# EAGLE board Main Board - Double (EAGLE 9.6.2)
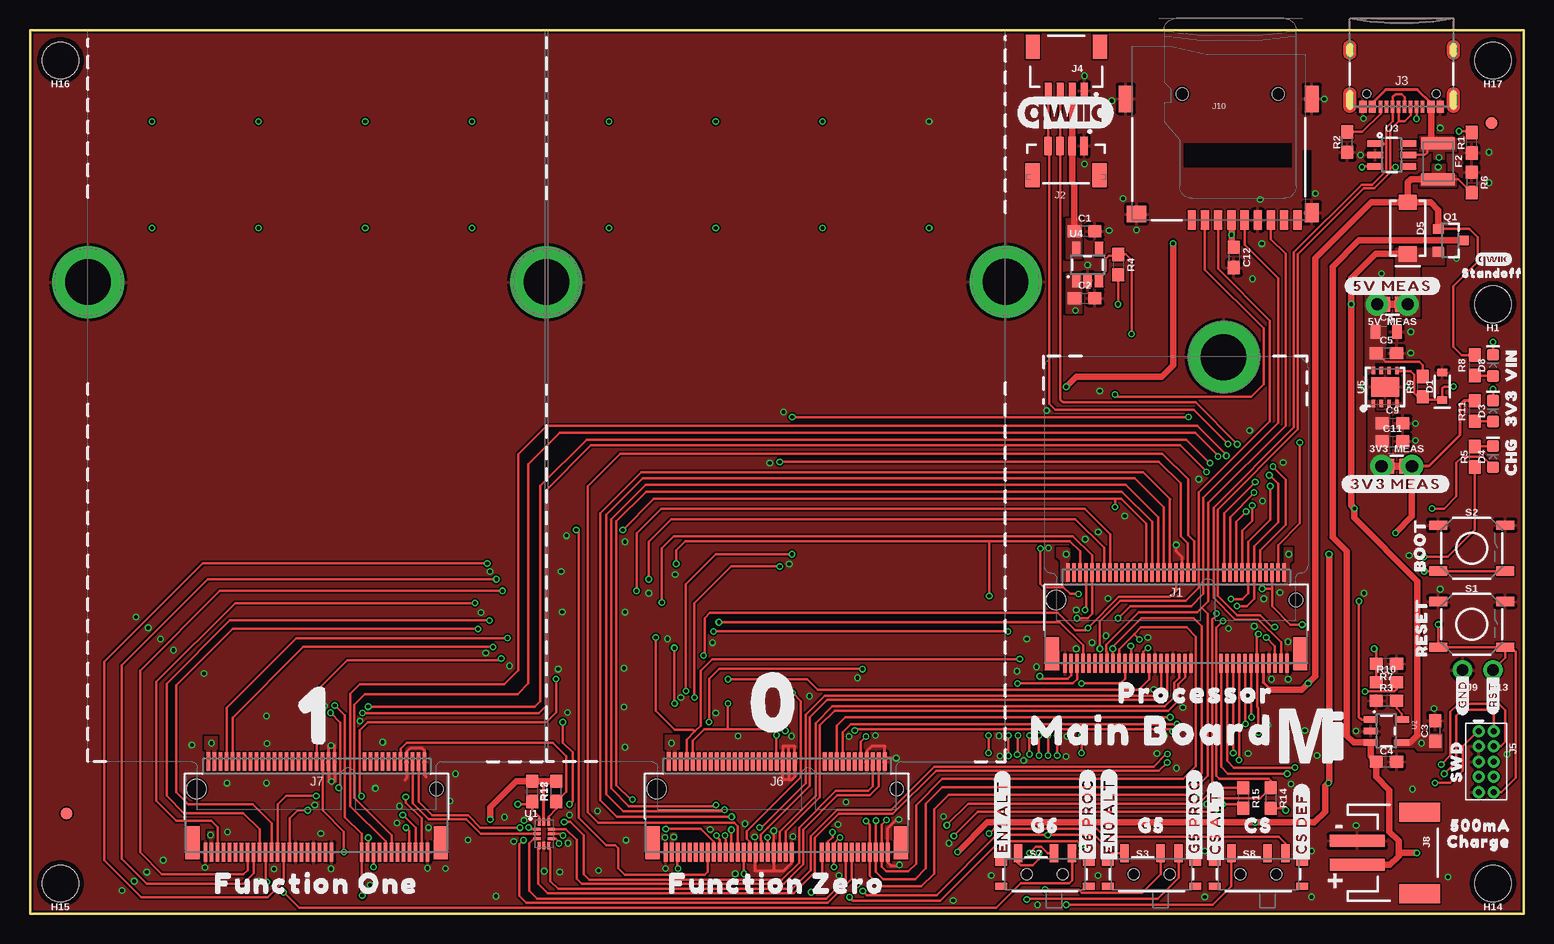
[diagram p1: board, top side]
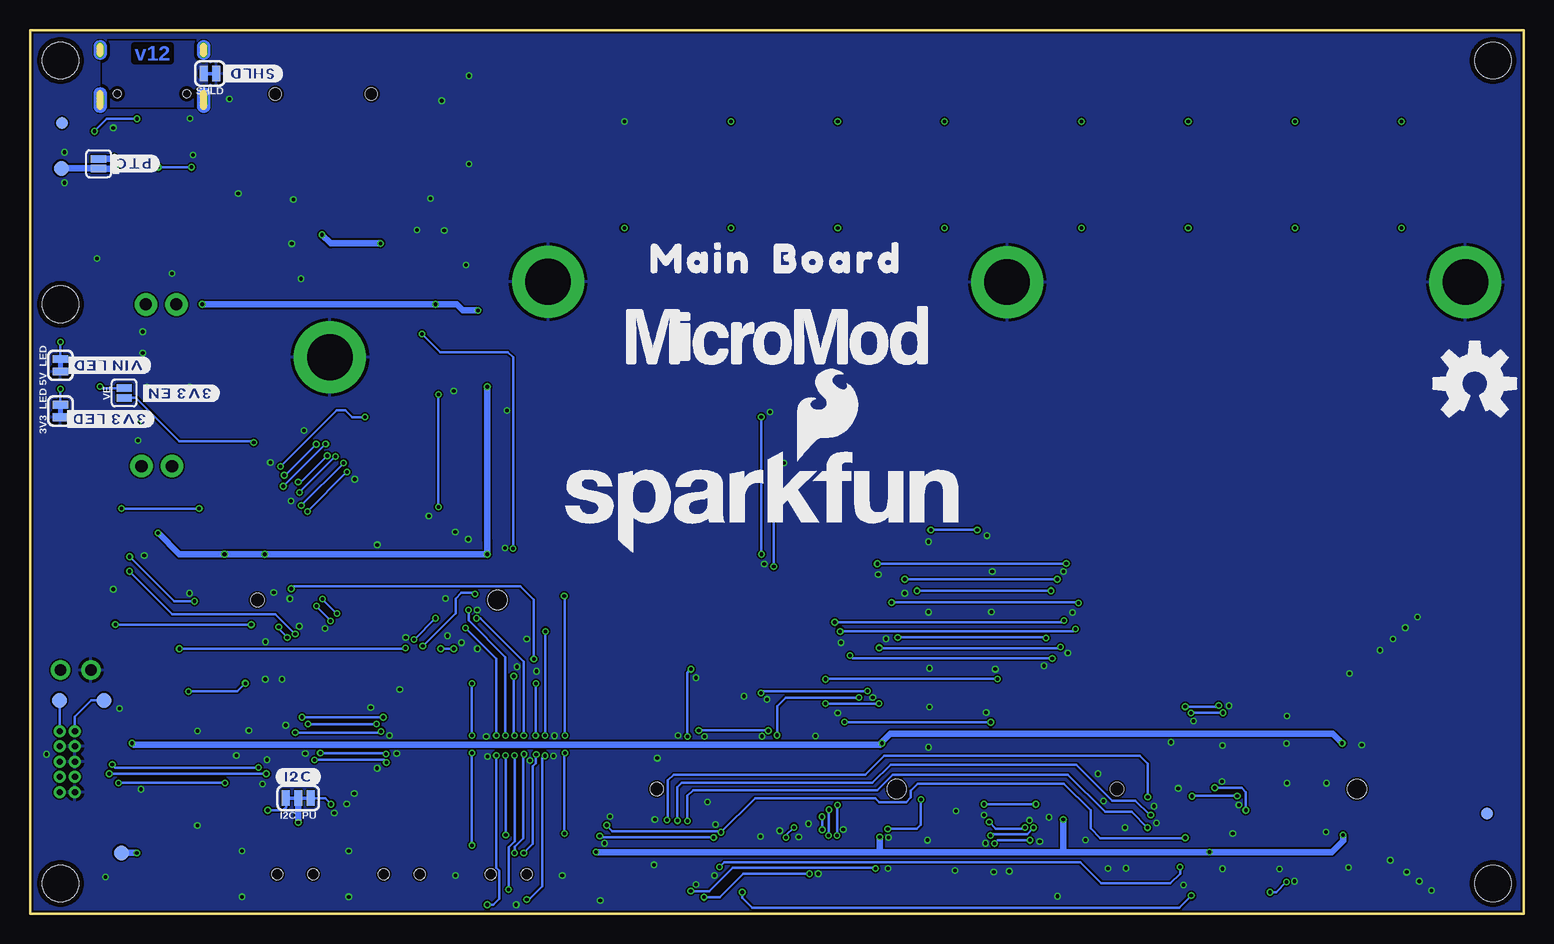
[diagram p2: board, bottom side, seen from below]

Size 124.46 x 73.66 mm. Coordinates in mm from the lower left corner, seen from the top.
Outline: 0,73.66 124.46,73.66 124.46,0 0,0 0,73.66
Copper layers (1*16): Top 0.035mm / dielectric 1.5mm / Bottom 0.035mm
Design rules "SparkFun-2-Layer-Minimum-JLCPCB": minimum track width 5mil, minimum drill 0.3mm, track to track 5mil, track to pad 5mil, pad to pad 5mil, via to via 5mil, smd to smd 5mil, copper to edge 7mil, drill to drill 7mil, minimum pad ring 5mil, minimum via ring 5mil, stop-mask expansion 2.5mil, vias tented up to drill 25mil, thermal gap 10mil
Net classes: 0 default: width 0.178 mm, drill 0.305 mm; 1 POWER: width 0.559 mm, drill 0.305 mm; 2 Diff pairs: width 0.203 mm, drill 0.305 mm
tRestrict: area 25.1,12.5 to 25.2,12.9; area 25.6,12.5 to 25.7,12.9; area 62.9,12.5 to 63,12.9; area 63.4,12.5 to 63.6,12.9

## Footprints (pad centres in the part's own frame; a part is rotated, then mirrored left to right if it is on the bottom)
SMT-JUMPER_2_NC_TRACE_SILK = smd 0.66 x 1.27: 1 -0.521,0; 2 0.521,0
COMBO-JUMPER_2_NC_TRACE = smd 0.635 x 1.27: 1 -0.508,0; 2 0.508,0 | drill 1.016 pad 1.88: 3 -1.27,0; 4 1.27,0
SMT-JUMPER_2_NO_SILK = smd 0.635 x 1.27: 1 -0.406,0; 2 0.406,0
0603 = smd 1.1 x 1: 1 -0.85,0; 2 0.85,0
0805 = smd 0.8 x 1.2: 1 -0.9,0; 2 0.9,0
SOD-323 = smd 0.63 x 0.83: A 1.15,0; C -1.15,0
LED-0603 = smd 1 x 1: A -0.877,0; C 0.877,0
SMA-DIODE = smd 1.27 x 1.47: A -2.15,0; C 2.15,0
1210 = smd 1 x 2.8: 1 -1.5,0; 2 1.5,0
FIDUCIAL-1X2 = smd 1 x 1: 1 0,0
STAND-OFF-TIGHT = hole 3.048: 0,0
STAND-OFF-REFLOW-M2.5 = drill 3.8 pad 6: 1 0,0
SMT-JUMPER_3_2-NC_TRACE_SILK = smd 0.66 x 1.27: 1 -1.041,0; 2 0,0; 3 1.041,0
M.2-CONNECTOR-E = smd 0.3 x 1.55: 1 9.25,-5.275; 2 9,2.275; 3 8.75,-5.275; 4 8.5,2.275; 5 8.25,-5.275; 6 8,2.275; 7 7.75,-5.275; 8 7.5,2.275; 9 7.25,-5.275; 10 7,2.275; 11 6.75,-5.275; 12 6.5,2.275; 13 6.25,-5.275; 14 6,2.275; 15 5.75,-5.275; 16 5.5,2.275; 17 5.25,-5.275; 18 5,2.275; 19 4.75,-5.275; 20 4.5,2.275; 21 4.25,-5.275; 22 4,2.275; 23 3.75,-5.275; 32 1.5,2.275; 33 1.25,-5.275; 34 1,2.275; 35 0.75,-5.275; 36 0.5,2.275; 37 0.25,-5.275; 38 0,2.275; 39 -0.25,-5.275; 40 -0.5,2.275; 41 -0.75,-5.275; 42 -1,2.275; 43 -1.25,-5.275; 44 -1.5,2.275; 45 -1.75,-5.275; 46 -2,2.275; 47 -2.25,-5.275; 48 -2.5,2.275; 49 -2.75,-5.275; 50 -3,2.275; 51 -3.25,-5.275; 52 -3.5,2.275; 53 -3.75,-5.275; 54 -4,2.275; 55 -4.25,-5.275; 56 -4.5,2.275; 57 -4.75,-5.275; 58 -5,2.275; 59 -5.25,-5.275; 60 -5.5,2.275; 61 -5.75,-5.275; 62 -6,2.275; 63 -6.25,-5.275; 64 -6.5,2.275; 65 -6.75,-5.275; 66 -7,2.275; 67 -7.25,-5.275; 68 -7.5,2.275; 69 -7.75,-5.275; 70 -8,2.275; 71 -8.25,-5.275; 72 -8.5,2.275; 73 -8.75,-5.275; 74 -9,2.275; 75 -9.25,-5.275 | smd 1.2 x 2.75: A1 10.35,-4.5; A2 -10.35,-4.5 | hole 1.1: 10,0 | hole 1.6: -10,0
JST04_1MM_VERT = smd 0.6 x 1.55: 1 -1.478,0.775; 2 -0.478,0.775; 3 0.522,0.775; 4 1.522,0.775 | smd 1.2 x 2: NC1 -2.778,3.2; NC2 2.822,3.2
USB-C-16P-2LAYER-PADS = smd 0.3 x 1: A5 -1.25,-0.34; A6 -0.25,-0.34; A7 0.25,-0.34; A8 1.25,-0.34; B5 1.75,-0.34; B6 0.75,-0.34; B7 -0.75,-0.34; B8 -1.75,-0.34 | smd 0.6 x 1: GND -3.225,-0.34; GND2 3.225,-0.34; VBUS1 -2.45,-0.34; VBUS2 2.45,-0.34 | drill 0.4 pad 0.6 long: SHLD1 -4.318,-0.915; SHLD2 4.318,-0.915; SHLD3 -4.318,-5.095; SHLD4 4.318,-5.095 | hole 0.65: -2.89,-1.445; 2.89,-1.445
JST04_1MM_RA = smd 0.6 x 1.35: 1 -1.5,0; 2 -0.5,0; 3 0.5,0; 4 1.5,0 | smd 1.2 x 2: NC1 2.8,-3.675; NC2 -2.8,-3.675
2X5-PTH-1.27MM = drill 0.508 pad 1: 1 -2.54,-0.635; 2 -2.54,0.635; 3 -1.27,-0.635; 4 -1.27,0.635; 5 0,-0.635; 6 0,0.635; 7 1.27,-0.635; 8 1.27,0.635; 9 2.54,-0.635; 10 2.54,0.635
M.2-CONNECTOR-E-FUNCTION-STANDARD = smd 0.3 x 1.55: 1 9.25,-5.275; 2 9,2.275; 3 8.75,-5.275; 4 8.5,2.275; 5 8.25,-5.275; 6 8,2.275; 7 7.75,-5.275; 8 7.5,2.275; 9 7.25,-5.275; 10 7,2.275; 11 6.75,-5.275; 12 6.5,2.275; 13 6.25,-5.275; 14 6,2.275; 15 5.75,-5.275; 16 5.5,2.275; 17 5.25,-5.275; 18 5,2.275; 19 4.75,-5.275; 20 4.5,2.275; 21 4.25,-5.275; 22 4,2.275; 23 3.75,-5.275; 32 1.5,2.275; 33 1.25,-5.275; 34 1,2.275; 35 0.75,-5.275; 36 0.5,2.275; 37 0.25,-5.275; 38 0,2.275; 39 -0.25,-5.275; 40 -0.5,2.275; 41 -0.75,-5.275; 42 -1,2.275; 43 -1.25,-5.275; 44 -1.5,2.275; 45 -1.75,-5.275; 46 -2,2.275; 47 -2.25,-5.275; 48 -2.5,2.275; 49 -2.75,-5.275; 50 -3,2.275; 51 -3.25,-5.275; 52 -3.5,2.275; 53 -3.75,-5.275; 54 -4,2.275; 55 -4.25,-5.275; 56 -4.5,2.275; 57 -4.75,-5.275; 58 -5,2.275; 59 -5.25,-5.275; 60 -5.5,2.275; 61 -5.75,-5.275; 62 -6,2.275; 63 -6.25,-5.275; 64 -6.5,2.275; 65 -6.75,-5.275; 66 -7,2.275; 67 -7.25,-5.275; 68 -7.5,2.275; 69 -7.75,-5.275; 70 -8,2.275; 71 -8.25,-5.275; 72 -8.5,2.275; 73 -8.75,-5.275; 74 -9,2.275; 75 -9.25,-5.275 | smd 1.2 x 2.75: A1 10.35,-4.5; A2 -10.35,-4.5 | hole 1.1: 10,0 | hole 1.6: -10,0
JST-2-SMD = smd 1 x 4.6: 1 -1,-3.7; 2 1,-3.7 | smd 1.6 x 3.4: NC1 -3.4,1.5; NC2 3.4,1.5
1X01_NO_SILK = drill 0.95 pad 1.6: 1 0,0
MICROSD-EXTERNALPIN = smd 0.7 x 1.6: 1 2.25,10.5; 2 1.15,10.5; 3 0.05,10.5; 4 -1.05,10.5; 5 -2.15,10.5; 6 -3.25,10.5; 7 -4.35,10.5; 8 -5.45,10.5; 9 -6.55,10.5 | smd 1.2 x 1.6: 10 -7.75,9.9 | smd 1.2 x 2.2: 11 -7.75,0.4; 12 7.75,0.4 | smd 1.6 x 1.4: 13 6.85,10 | hole 1: 3.05,0; -4.95,0
SOT23-3 = smd 0.8 x 0.9: 1 -0.95,-1; 2 0.95,-1; 3 0,1.1
TACTILE_SWITCH_SMD_5.2MM = smd 1.524 x 0.762: 1 -2.794,1.905; 2 2.794,1.905; 3 -2.794,-1.905; 4 2.794,-1.905
SWITCH_SPST_SMD_A = smd 0.7 x 1.5: 1 -2.25,-1.75; 2 -0.75,-1.75; 3 2.25,-1.75 | smd 1 x 0.6: GND1 -3.65,1; GND3 3.65,1 | smd 1 x 0.8: GND2 -3.65,-1.1; GND4 3.65,-1.1 | hole 0.9: -1.5,0; 1.5,0
PAD.03X.05 = smd 1.27 x 1.27: 1 0,0
STG3856 = smd 0.6 x 0.25: P1 -0.59,0.41; P2 -0.59,0.01; P3 -0.59,-0.39; P7 0.58,-0.39; P8 0.58,0.01; P9 0.58,0.41 | smd 0.25 x 0.6: P4 -0.42,-0.96; P5 -0.02,-0.96; P6 0.38,-0.96; P10 0.38,1.01; P11 -0.02,1.01; P12 -0.42,1.01
SOT23-5 = smd 0.55 x 1.2: 1 -0.95,-1.3; 2 0,-1.3; 3 0.95,-1.3; 4 0.95,1.3; 5 -0.95,1.3
SOT-23-6 = smd 0.55 x 1.35: 1 -0.95,-1.375; 2 0,-1.375; 3 0.95,-1.375; 4 0.95,1.375; 5 0,1.375; 6 -0.95,1.375
SOT25 = smd 0.7 x 1.2: 1 -0.95,-1.3; 2 0,-1.3; 3 0.95,-1.3; 4 0.95,1.3; 5 -0.95,1.3
UDFN-8 = smd 0.3 x 0.65: 1 -0.975,-1.375; 2 -0.325,-1.375; 3 0.325,-1.375; 4 0.975,-1.375; 5 0.975,1.375; 6 0.325,1.375; 7 -0.325,1.375; 8 -0.975,1.375 | smd 2.35 x 1.6: EP 0,0

## Placement (x,y rotation side)
3V3_LED  JUMPER-SMT_2_NC_TRACE_SILK  [SMT-JUMPER_2_NC_TRACE_SILK]  121.92,41.91 90 bottom
3V3_MEAS  JUMPER-COMBO_2_NC_TRACE  [COMBO-JUMPER_2_NC_TRACE]  113.89,37.31 0 top
5V_LED  JUMPER-SMT_2_NC_TRACE_SILK  [SMT-JUMPER_2_NC_TRACE_SILK]  121.92,45.72 90 bottom
5V_MEAS  JUMPER-COMBO_2_NC_TRACE  [COMBO-JUMPER_2_NC_TRACE]  113.54,50.8 180 top
BYP  JUMPER-SMT_2_NO_SILK  [SMT-JUMPER_2_NO_SILK]  118.75,62.51 270 bottom
C1  1.0uF  [0603]  87.88,56.9 0 top
C2  1.0uF  [0603]  87.88,51.31 0 top
C3  4.7uF  [0603]  117.09,15.24 90 top
C4  4.7uF  [0603]  113.03,12.7 0 top
C5  0.1uF  [0603]  113.03,46.74 0 top
C8  10uF  [0805]  113.03,48.51 0 top
C9  1.0uF  [0603]  113.54,40.89 0 top
C11  2.2uF  [0603]  113.54,39.37 0 top
C12  10uF  [0603]  100.33,54.71 270 top
D1  3.3V  [SOD-323]  117.7,43.97 90 top
D3  RED  [LED-0603]  121.92,41.91 90 top
D4  Yellow  [LED-0603]  121.92,38.1 90 top
D5  3A/40V/500mV  [SMA-DIODE]  114.81,57.15 270 top
D8  RED  [LED-0603]  121.92,45.72 90 top
F2  6V/2A  [1210]  117.35,62.74 270 top
FD1  FIDUCIAL1X2  [FIDUCIAL-1X2]  3.05,8.38 180 bottom
FD2  FIDUCIAL1X2  [FIDUCIAL-1X2]  3.05,8.38 180 top
FD3  FIDUCIAL1X2  [FIDUCIAL-1X2]  121.79,65.91 270 top
FD4  FIDUCIAL1X2  [FIDUCIAL-1X2]  121.79,65.91 90 bottom
FRAME1  FRAME-LEDGER  [CREATIVE_COMMONS]  16.51,-25.4 0 top  (outside the outline)
FRAME2  FRAME-LEDGERNO_FOOTPRINT  [DUMMY]  16.51,-25.4 0 top  (outside the outline)
H1  STAND-OFFTIGHT  [STAND-OFF-TIGHT]  121.92,50.8 180 top
H2  STAND-OFF-REFLOW-M2.5_2.5MM_TALL  [STAND-OFF-REFLOW-M2.5]  43.04,52.65 180 top
H3  STAND-OFF-REFLOW-M2.5_2.5MM_TALL  [STAND-OFF-REFLOW-M2.5]  4.84,52.65 90 top
H4  STAND-OFF-REFLOW-M2.5_2.5MM_TALL  [STAND-OFF-REFLOW-M2.5]  81.29,52.68 90 top
H8  STAND-OFF-REFLOW-M2.5_2.5MM_TALL  [STAND-OFF-REFLOW-M2.5]  99.46,46.39 90 top
H14  STAND-OFFTIGHT  [STAND-OFF-TIGHT]  121.92,2.54 180 top
H15  STAND-OFFTIGHT  [STAND-OFF-TIGHT]  2.54,2.54 180 top
H16  STAND-OFFTIGHT  [STAND-OFF-TIGHT]  2.54,71.12 180 top
H17  STAND-OFFTIGHT  [STAND-OFF-TIGHT]  121.92,71.12 180 top
I2C_PU  JUMPER-SMT_3_2-NC_TRACE_SILK  [SMT-JUMPER_3_2-NC_TRACE_SILK]  102.11,9.65 180 bottom
J1  MICROMOD-2222-C  [M.2-CONNECTOR-E]  95.5,26.16 0 top
J2  Vertical Qwiic Connector  [JST04_1MM_VERT]  86.36,64.77 180 top
J3  [USB-C-16P-2LAYER-PADS]  114.3,66.9 180 top
J4  QWIIC_RIGHT_ANGLE  [JST04_1MM_RA]  86.36,68.58 180 top
J5  CORTEX_JTAG_DEBUG_MINIMUM_PTH  [2X5-PTH-1.27MM]  121.35,12.69 270 top
J6  MICROMOD_FUNCTION_MAIN  [M.2-CONNECTOR-E-FUNCTION-STANDARD]  62.23,10.41 0 top
J7  MICROMOD_FUNCTION_MAIN  [M.2-CONNECTOR-E-FUNCTION-STANDARD]  23.88,10.41 0 top
J8  [JST-2-SMD]  114.3,5.08 270 top
J9  [1X01_NO_SILK]  119.38,20.32 180 top
J10  MICRO-SD-PUSH-PUSH-EXT-PIN  [MICROSD-EXTERNALPIN]  99.06,68.33 180 top
J13  [1X01_NO_SILK]  121.92,20.32 180 top
LOGO1  QWIIC_LOGO_8MM  [QWIIC_8MM]  86.31,66.75 0 top
LOGO2  SFE_LOGO_NAME_FLAME.3_INCH  [SFE_LOGO_NAME_FLAME_.3]  63.5,34.29 0 bottom
LOGO3  OSHW-LOGOL  [OSHW-LOGO-L]  4.06,44.2 0 bottom
Q1  3.1A/30V/105mΩ  [SOT23-3]  118.36,56.13 270 top
R1  5.1k  [0603]  120.14,64.26 90 top
R2  5.1k  [0603]  109.78,64.31 90 top
R3  2.0k  [0603]  113.03,17.78 0 top
R4  100k  [0603]  90.68,54.1 270 top
R5  4.7k  [0603]  120.4,38.1 90 top
R6  10k  [0603]  120.14,60.96 270 top
R7  10k  [0603]  113.03,20.83 180 top
R8  2.2k  [0603]  120.4,45.72 90 top
R9  100k  [0603]  116.08,43.94 90 top
R10  20k  [0603]  113.03,19.3 0 top
R11  1k  [0603]  120.4,41.91 90 top
R12  100k  [0603]  43.87,10.21 90 top
R13  100k  [0603]  41.83,10.21 270 top
R14  2.2k  [0603]  103.38,9.65 270 top
R15  2.2k  [0603]  101.09,9.65 270 top
S1  Reset  [TACTILE_SWITCH_SMD_5.2MM]  120.14,24.13 0 top
S2  BOOT  [TACTILE_SWITCH_SMD_5.2MM]  120.14,30.48 0 top
S3  [SWITCH_SPST_SMD_A]  93.47,3.3 180 top
S7  [SWITCH_SPST_SMD_A]  84.58,3.3 180 top
S8  [SWITCH_SPST_SMD_A]  102.36,3.3 180 top
SHLD  JUMPER-SMT_2_NC_TRACE_SILK  [SMT-JUMPER_2_NC_TRACE_SILK]  109.47,70.03 180 bottom
TP1  TEST-POINT3X5  [PAD.03X.05]  122.02,17.8 180 bottom
TP2  TEST-POINT3X5  [PAD.03X.05]  118.29,17.79 0 bottom
TP3  TEST-POINT3X5  [PAD.03X.05]  116.84,5.08 90 bottom
TP4  TEST-POINT3X5  [PAD.03X.05]  121.84,62.13 180 bottom
U1  STG3856QTR  [STG3856]  42.85,6.65 0 top
U2  MCP73831  [SOT23-5]  113.03,15.24 270 top
U3  ESD Diode  [SOT-23-6]  113.49,63.25 270 top
U4  AP7347DQ-33W5-7K-3.3V  [SOT25]  88.14,54.1 0 top
U5  AP7361C-33  [UDFN-8]  112.93,43.92 0 top
U$1  [#3V3_EN#502]  112.01,43.38 180 bottom
U$2  [#3V3_LED#502]  117.91,41.25 180 bottom
U$3  [#PTC#503]  115.87,62.53 180 bottom
U$4  [3V332533]  123.44,42.16 90 top
U$5  [VIN32532]  123.44,45.72 90 top
U$6  [CHG32531]  123.44,38.1 90 top
U$7  [#SHLD#501]  105.97,70.03 180 bottom
U$8  [BOOT32541]  115.82,30.73 90 top
U$9  [RESET32540]  115.95,23.88 90 top
U$10  [PROCESSOR525]  97.16,18.41 0 top
U$11  [FUNCTION_ZERO520]  62.23,2.54 0 top
U$12  [FUNCTION_ONE524]  23.88,2.54 0 top
U$13  [MAIN523]  68.58,54.61 0 bottom
U$14  [MICROMOD_MI_LOGO_1]  106.81,14.86 0 top
U$15  [0523]  62.23,17.53 0 top
U$16  [1524]  23.88,16.51 0 top
U$17  [MICROMOD_LOGO_1]  62.23,48.26 0 bottom
U$18  [BOARD524]  57.15,54.61 0 bottom
U$19  [G518]  93.47,7.37 0 top
U$20  [#CS_ALT#20]  98.78,7.59 90 top
U$21  [MAIN_BOARD5523]  93.47,15.27 0 top
U$22  [QWIIC_3MM]  121.97,54.56 0 top
U$23  [STANDOFF501]  121.84,53.39 0 top
U$24  [SFE_LOGO_FLAME_.3]  130.3,58.67 180 top  (outside the outline)
U$25  [SWD6522]  118.87,12.7 90 top
U$26  [#3V3_MEAS#6522]  113.79,35.81 0 top
U$27  [CHARGE501]  120.73,6.02 0 top
U$28  [#VIN_LED#502]  117.98,45.72 180 bottom
U$29  [G6519]  84.58,7.37 0 top
U$30  [#I2C#501]  102.11,11.43 0 bottom
U$31  [#5V_MEAS#6522]  113.54,52.32 0 top
U$32  [CS17]  102.36,7.37 0 top
U$33  [500MA6520]  120.9,7.37 0 top
U$34  [#CS_DEF#19]  105.97,7.52 90 top
U$35  [#G5_PROC#21]  97.03,8.13 90 top
U$36  [#G6_PROC#21]  88.14,8.13 90 top
U$37  [#EN0_ALT#21]  89.92,8.13 90 top
U$38  [#EN1_ALT#21]  81.03,8.13 90 top
U$39  [#RST#6521]  121.92,18.29 90 top
U$40  [#GND#6520]  119.38,18.29 90 top
VE  JUMPER-SMT_2_NO_SILK  [SMT-JUMPER_2_NO_SILK]  116.61,43.41 90 bottom

## Tracks (layer width: path | path; a pad name or v marks a point on that pad's centre or on a via)
3.3V  (via drill 0.3, 0.35)
  Top 0.203: v117.09,10.92 118.36,10.92 119.38,11.94 119.38,13.97 120.64,15.23 J5.1 | J7.36 24.38,8.64 26.16,6.86 v26.16,5.16
  Top 0.254: R11.2 119.47,42.76 119.13,42.42 119.13,39.88 116.56,37.31 3V3_MEAS.4 | U1.P11 42.83,11.06
  Top 0.559: v108.25,29.97 108.25,10.97 v108.2,10.92 107.95,10.67 107.95,8.53 107.04,7.62 v102.11,7.62 79.76,7.62 v77.29,5.16 | C12.1 100.13,55.77 v100.13,56.59 100.13,57.81 J10.4 | v38.35,7.87 38.35,8.89 40.52,11.06 R13.1 42.83,11.06 R12.2 | v113.79,31.75 115.16,33.12 3V3_MEAS.4 3V3_MEAS.2 | v86.36,43.94 87.2,44.78 94.31,44.78 95.25,45.72 v95.25,55.88
  Bottom 0.203: v117.09,10.92 v108.2,10.92 | TP2.1 119.37,17.79 120.71,16.45 J5.1
  Bottom 0.559: v86.36,43.94 86.36,31.16 86.36,31.17 v86.36,29.97 v104.9,29.97 v108.25,29.97 112.01,29.97 v113.79,31.75 | v15.04,6.58 15.04,6.1 15.98,5.16 v26.16,5.16 38.35,5.16 | v77.29,5.16 53.7,5.16 | 53.7,5.16 38.35,5.16 | v38.35,7.87 38.35,5.16 | v53.65,6.4 53.65,5.21 53.7,5.16 | v95.25,55.88 99.42,55.88 v100.13,56.59 | I2C_PU.2 v102.11,7.62
  pour Top (isolate 0.305, no thermals): 86.59,27.74 86.59,30.45 85.62,30.45 85.62,29.77 85.95,29.44 85.95,27.74
  pour Top (isolate 0.305, no thermals): 104.39,27.69 104.9,27.69 104.9,29.21 105.16,29.46 105.16,30.48 104.39,30.48
  pour Top (no thermals): 53.62,4.6 53.34,4.6 53.34,6.71 53.85,6.71 53.85,6.15 53.62,6.15
  pour Top (no thermals): 15.24,4.85 14.99,4.85 14.99,6.3 14.81,6.3 14.81,6.88 15.37,6.88 15.37,6.3 15.24,6.3
3.3V_EN  (via drill 0.3)
  Top 0.203: v105.82,39.29 105.82,32.54 104,30.73 J1.4
  Bottom 0.203: v105.82,39.29 105.89,39.37 112.01,39.37 115.65,43 VE.1
3.3V_EN_VE  (via drill 0.3)
  Top 0.203: U5.5 113.98,45.21 115.06,45.21 115.35,44.92 115.35,43.38 115.64,43.09 R9.1 116.33,42.84 117.68,42.84 D1.C 117.7,43.79 117.86,43.94 v118.62,43.94
  Bottom 0.203: VE.2 118.49,43.81 v118.62,43.94
3.3V_QWIIC
  Top 0.559: C1.1 87.03,60.79 86.84,60.99 J2.2 86.86,64.02 J4.2
  pour Top (no thermals): 87.63,54.61 87.63,57.91 86.36,57.91 86.36,54.61
!BOOT!  (via drill 0.3)
  Top 0.203: S2.4 S2.3 117.32,28.55 v116.18,28.55 | v102.36,23.32 102.23,23.19 102.23,20.91 J1.11 102.25,17.26 102.36,17.15 v102.36,15.11 | v95.22,15.21 95.06,15.38 68.82,15.38 v68.73,15.29 | v62.94,15.27 62.81,15.39 58.17,15.39 | J6.66 55.23,14.44 56.19,15.39 58.17,15.39 | J7.66 16.88,16.34 22.78,22.25 v38.58,22.25 | v53.7,22.17 53.7,17.55 v53.72,17.53 | v58.17,17.53 58.17,15.39
  Bottom 0.203: v102.36,23.32 104.01,24.97 112.6,24.97 v116.18,28.55 | v102.36,15.11 95.38,15.11 95.25,15.24 v95.22,15.21 | v62.94,15.27 62.94,15.29 62.97,15.32 68.71,15.32 v68.73,15.29 | v38.58,22.25 38.71,22.12 53.65,22.12 v53.7,22.17 | v53.72,17.53 v58.17,17.53
!CS0!-PROCESSOR  (via drill 0.3)
  Top 0.203: J6.49 59.49,3.38 v59.51,3.35 | v68.3,1.4 68.58,1.12 75.87,1.12 80.81,6.05 87.29,6.05 v87.63,5.71 | J1.55 91.25,19.62 90.84,19.2 v87.63,19.2 | v87.63,14.87 v87.63,13.41
  Bottom 0.203: v59.51,3.35 65.02,3.35 66.98,1.4 v68.3,1.4 | v87.63,19.2 v87.63,14.87 | v87.63,13.41 v87.63,5.71
!CS1!-PROCESSOR  (via drill 0.3)
  Top 0.203: J1.70 87.5,30.23 86.67,31.06 79.93,31.06 | 79.93,31.06 54.61,31.06 53.85,30.3 v53.85,29.18 | J7.49 21.13,2.71 19.81,1.4 9.27,1.4 6.2,4.47 6.2,21 14.4,29.21 v38.1,29.21 | v79.92,6.71 79.96,6.71 80.36,7.1 88.9,7.1 89.58,6.43 104.06,6.43 104.61,5.88 S8.1 | v79.88,13.41 v79.88,14.87 | v79.93,26.49 79.93,31.06
  Bottom 0.203: v53.85,29.18 38.12,29.18 v38.1,29.21 | v79.92,6.71 79.92,13.37 v79.88,13.41 | v79.88,14.87 79.88,26.44 v79.93,26.49
!DFU-FC0!  (via drill 0.3)
  Top 0.203: U1.P12 42.43,8.11 41.83,8.71 R13.2 41.62,9.14 v40.64,9.14 | v69.37,20.4 69.32,20.45 57.45,20.45 56.59,19.58 v56.59,16 | v44.4,15.98 44.4,14.28 45.21,13.46 45.21,9.4 v44.96,9.14 | v69.67,14.8 69.23,14.35 J6.10
  Bottom 0.203: v69.37,20.4 69.67,20.09 v69.67,14.8 | v44.4,15.98 56.57,15.98 v56.59,16 | v40.64,9.14 v44.96,9.14
!DFU-FC1!
  Top 0.203: U1.P10 43.23,8.11 43.87,8.75 R12.1 44.7,10.2 44.7,13.13 43.56,14.28 31.39,14.28 30.88,13.76 J7.10
!RESET!  (via drill 0.3)
  Top 0.203: v106.02,24.11 105.03,24.11 103.5,25.63 103.5,27.1 | J1.6 103.5,27.1 | v117.35,24.13 S1.3 S1.4 | J5.10 122.62,10.15 123.83,11.36 123.83,21.84 123.44,22.23 S1.4 | v102.69,27.1 103.5,27.1 | v82.47,21.23 56.87,21.23 55.9,20.26 55.9,15.7 55.41,15.21 | 55.41,15.21 54.73,14.53 J6.68 | J7.68 16.38,17.16 22.2,22.99 v39.8,22.99 | v52.15,23.04 52.15,16.94 53.72,15.37 55.24,15.37 55.41,15.21 | J13.1 122.94,21.34 S1.4
  Bottom 0.203: v106.02,24.11 117.32,24.11 v117.35,24.13 | v102.69,27.1 102.49,27.3 83.6,27.3 82.47,26.18 v82.47,21.23 | v39.8,22.99 39.85,23.04 v52.15,23.04
A0-PROCESSOR  (via drill 0.3)
  Top 0.203: J1.34 96.48,28.46 96.48,30.89 95.88,31.49 95.88,35.87 94.08,37.67 v62.48,37.67 | v62.48,28.96 58.42,28.96 55.37,25.91 v55.37,18.03 | J6.38 62.2,12.71 v62.2,14.88
  Bottom 0.203: v62.48,37.67 v62.48,28.96 | v55.37,18.03 61.47,18.03 62.2,17.3 v62.2,14.88
A1-PROCESSOR/!CS1!-ALT  (via drill 0.3)
  Top 0.203: J1.38 95.5,26.95 94.98,26.43 90.73,26.43 88.17,23.86 v88.17,23.82 87.97,23.62 87.12,23.62 85.66,25.08 56.66,25.08 56.21,24.64 56.21,21.61 v56.13,21.54 | v85.6,14.87 v85.6,13.21 | J7.38 23.88,18.59 26.44,21.16 39.14,21.16 v39.27,21.29 | v86.36,0.76 98.55,0.76 100.11,2.32 S8.3
  Bottom 0.203: v88.17,23.82 85.61,21.26 85.61,14.88 v85.6,14.87 | v39.27,21.29 55.88,21.29 v56.13,21.54 | v86.36,0.76 85.85,0.76 85.35,1.26 85.35,3.6 85.6,3.85 v85.6,13.21
CTS1-PROCESSOR  (via drill 0.3)
  Top 0.203: J1.15 101.25,15.87 v101.3,15.82 | v95.58,15.82 68.4,15.82 67.73,15.15 J6.16
  Bottom 0.203: v95.58,15.82 v101.3,15.82
D0-PROCESSOR  (via drill 0.3)
  Top 0.203: J1.10 102.5,30.29 104.65,32.44 104.65,36.2 103.58,37.26 v103.58,37.29 | v63.52,41.4 v96.55,41.4 | 54.66,18.82 54.66,27.48 57.15,29.97 v63.5,29.97 | v63.55,18.41 64.24,17.73 64.24,11.38 59.74,6.88 59.74,6.27 59.98,6.04 J6.47 | v54.66,18.57 54.66,18.82 | 54.66,18.82
  Bottom 0.203: v96.55,41.4 97.59,41.4 98.17,41.99 98.88,41.99 v103.58,37.29 | v63.52,41.4 63.52,30 v63.5,29.97 | v54.66,18.57 63.4,18.57 v63.55,18.41
D1-PROCESSOR  (via drill 0.3)
  Top 0.203: J1.18 100.5,32.69 v101.35,33.53 | v98.04,36.83 95.83,39.04 46.74,39.04 42.98,35.28 42.98,17.32 42.39,16.74 v27.71,16.74 | v23.14,8.64 22.3,8.64 21.63,7.96 J7.47 | v25.73,10.52 25.86,10.64 25.86,15.95 v25.04,16.76
  Bottom 0.203: v101.35,33.53 v98.04,36.83 | v25.73,10.52 23.5,10.52 23.14,10.16 v23.14,8.64 | v25.04,16.76 27.69,16.76 v27.71,16.74
D+
  Top 0.203: J1.3 104.25,22.64 102.36,24.54 100.44,24.54 98.63,26.34 98.63,33.86 105.33,40.56 105.33,55.13 110.99,60.78 111.87,60.78 113.03,61.94 113.03,64.21 | J3.A6 114.55,68.08 114.3,68.33 113.79,68.33 113.55,68.08 J3.B6 113.55,66.05 113.03,65.53 113.03,64.21 | U3.1 113.02,64.2 113.03,64.21
D-  (via drill 0.3)
  Top 0.203: v103.73,23.9 103.5,23.9 102.51,24.89 100.58,24.89 98.96,26.52 98.96,33.68 105.66,40.39 105.66,54.99 111.12,60.45 112.01,60.45 113.36,61.8 113.36,62.23 | v103.02,23.04 103.73,22.33 103.73,20.91 J1.5 | J3.B7 115.05,66.54 114.55,66.04 114.05,66.04 | 114.05,66.04 113.36,65.35 113.36,62.23 | 113.36,62.23 v113.78,62.23 | v111,62.23 111.06,62.3 U3.3 | J3.A7 114.05,66.04
  Bottom 0.203: v103.02,23.04 103.73,23.75 v103.73,23.9 | v113.78,62.23 v111,62.23
G0-PROCESSOR  (via drill 0.3)
  Top 0.203: v58.47,8.1 48.9,8.1 47.53,9.47 47.53,33.39 50.94,36.8 92.78,36.8 95,34.57 95,34.56 J1.40 | J6.53 58.45,5.17 v58.45,7.01
  Bottom 0.203: v58.47,8.1 58.45,8.08 v58.45,7.01
G1-PROCESSOR  (via drill 0.3)
  Top 0.203: v57.89,8.69 57.76,8.56 49.43,8.56 48.03,9.96 48.03,33.26 51.07,36.3 92.06,36.3 94.46,33.9 94.46,28.48 J1.42 | v57.91,6.53 57.98,6.46 J6.55
  Bottom 0.203: v57.91,6.53 57.89,6.55 v57.89,8.69
G2-PROCESSOR  (via drill 0.3)
  Top 0.203: v57.17,9.07 57.1,8.99 49.91,8.99 48.43,10.47 48.43,32.88 51.3,35.75 91.32,35.75 94,33.06 J1.44 | v57.2,6.53 57.2,6.45 57.48,6.17 J6.57
  Bottom 0.203: v57.2,6.53 57.2,9.04 v57.17,9.07
G3-PROCESSOR  (via drill 0.3)
  Top 0.203: J1.46 93.5,32.68 90.99,35.2 51.35,35.2 48.87,32.71 48.87,10.74 50.09,9.53 v50.22,9.53 | v52.98,7.09 55.91,7.09 56.98,6.01 J6.59
  Bottom 0.203: v50.22,9.53 50.22,7.44 50.57,7.09 v52.98,7.09
G4-PROCESSOR/SD_CARD_!CS!  (via drill 0.3)
  Top 0.203: 90.42,34.59 90.93,34.59 93,32.52 J1.48 | 90.42,34.59 51.99,34.59 v49.39,31.99 | v90.42,43.28 90.6,43.1 101.75,43.1 102.79,44.15 102.79,48.79 97.91,53.68 J10.2 | v90.42,33.91 90.42,34.59 | v45.52,32 45.72,31.8 45.72,8.03 48.03,5.71 48.77,5.71 49.02,5.46 49.02,3.81 49.55,3.28 56.24,3.28 56.48,3.52 J6.61
  Bottom 0.203: v90.42,43.28 v90.42,33.91 | v45.52,32 49.38,32 v49.39,31.99
G5-JUMPER  (via drill 0.3)
  Top 0.203: v84.15,19.81 84.35,19.61 86.46,19.61 86.75,19.9 J1.73 | v84.07,14.87 v84.07,13.21 | v84.58,2.03 87.38,2.03 87.64,1.77 92.7,1.77 94.22,3.29 S3.2
  Bottom 0.203: v84.15,19.81 84.15,14.95 v84.07,14.87 | v84.58,2.03 84.58,5.55 84.07,6.05 v84.07,13.21
G5-PROCESSOR  (via drill 0.3)
  Top 0.203: v81.53,13.18 v81.53,14.87 | v56.95,23.55 v81.51,23.55 | J7.53 20.13,7.56 18.54,9.14 13.21,9.14 12.19,10.16 12.19,19.05 16.89,23.75 v37.34,23.75 | v83.06,1.19 83.14,1.27 93.98,1.27 95.72,3.01 S3.1
  Bottom 0.203: v81.53,14.87 81.51,14.9 v81.51,23.55 | v37.34,23.75 37.54,23.55 v56.95,23.55 | v81.53,13.18 81.76,12.95 81.76,2.31 82.88,1.19 v83.06,1.19
G6-JUMPER  (via drill 0.3)
  Top 0.203: v82.27,13.28 82.32,13.34 v82.32,14.87 | J1.71 87.25,19.56 86.9,19.2 v82.3,19.2 | v83.31,5.08 83.82,5.59 84.29,5.59 84.82,5.05 S7.2
  Bottom 0.203: v82.32,14.87 82.3,14.9 v82.3,19.2 | v82.27,13.28 82.3,13.26 82.3,12.57 82.55,12.31 82.55,5.84 v83.31,5.08
G6-PROCESSOR  (via drill 0.3)
  Top 0.203: v21.13,1.8 22.43,0.51 80.52,0.51 82.55,2.54 86.61,2.54 86.87,2.8 86.87,5.02 S7.1 | v19.76,2.67 19.63,2.8 J7.55
  Bottom 0.203: v19.76,2.67 20.62,1.8 v21.13,1.8
G7-PROCESSOR  (via drill 0.3)
  Top 0.203: v38.3,24.46 16.66,24.46 11.38,19.18 11.38,9.83 12.8,8.41 17.75,8.41 19.13,7.04 J7.57 | J1.69 87.75,22.39 85.83,24.31 v57.4,24.31
  Bottom 0.203: v38.3,24.46 38.46,24.31 v57.4,24.31
GND  (via drill 0.3)
  Top 0.203: J6.39 v61.98,6.93
  Top 0.254: 63.23,11.18 J6.34 63.23,13.93 arc-45 63.25,13.97 | 63.23,11.18 62.73,11.18 J6.36 62.73,13.95 arc-45 62.74,13.97 63.25,13.97 | 63.23,11.18 63.48,11.18 63.73,11.43 J6.32 63.73,13.97 63.25,13.97 | J6.2 71.23,12.95 | 71.23,12.95 71.23,13.97 70.13,13.97 69.73,13.57 J6.8 | v72.19,12.98 72.16,12.95 71.23,12.95 | 31.24,11.18 31.38,11.31 J7.8 31.38,13.49 31.7,13.82 32.66,13.82 32.88,13.61 J7.2 32.88,11.57 33.02,11.43 | v72.39,7.87 72.21,7.87 71.48,7.14 J6.1 71.48,4.29 71.75,4.01 72.39,4.01 v72.47,4.09 | J1.36 96,29.73 95.5,30.23 95.5,30.74 v95.52,30.76 | J6.39 61.98,3.56 | 61.98,3.56 60.45,3.56 60.45,5.11 J6.45 | J6.33 63.48,4.27 62.77,3.56 61.98,3.56 | J7.32 25.38,14.05 v25.09,14.05 24.88,14.05 J7.34 24.88,11.02 v25.12,11.02 25.38,11.02 J7.32
  other vias: 115.47,40.87 116.99,17.12 110.49,15.24 118.87,54.61 115.21,10.39 14.58,3.86 101.88,52.93 102.64,55.85 102.51,59.54 101.52,13.36 103.15,15.72 105.08,10.82 93.14,23.04 88.49,22.61 99.87,23.77 104.83,22.68 114.94,29.87 92.2,57 23.72,9.07 30.58,7.57 33.12,3.81 33.2,7.19 49.66,6.15 93.65,18.69 102.02,23.97 97.4,36.22 102.7,34.41 104.43,37.61 89.14,43.58 115.47,39.45 104.7,12.85 110.52,7.37 118.16,3.07 89.84,26.29 80.75,14.85 80.82,13.16 83.06,22.91 93.9,13.36 87.19,25.32 89.67,23.19 104.85,19.56 103.45,19.56 94.51,14.87 101.64,40.28 91.22,33.17 42.85,3.56 47.29,8.59 59.59,7.52 28.78,10.46 96.06,17.2 117.53,27.05 57.15,16.74 63.46,14.81 87.18,22.09 52.91,6.38 25.1,3.76 95.53,12.14 67.34,7.44 35.46,11.68 35,9.4 63.58,6.45 60.4,6.4 39.55,8.05 82.25,20.22 83.87,20.6 56.87,22.61 53.14,22.94 51.56,26.72 53.77,28.3 49.58,31.01 44.7,31.52 38.33,28.52 37.59,25.12 39.95,20.68 37.97,21.74 44.02,20.4 44.78,16.79 54.23,18.03 40.31,6.05 44.83,5.89 41.17,7.8 44.96,8.26 44.15,3.51 52.96,3.78 38.84,1.47 28.35,2.41 20.35,3.73 9.73,3.48 8.69,2.72 11.1,4.47 11.96,21.97 10.87,22.91 9.86,23.85 68.96,19.68 63.04,17.88 68.25,14.78 70.46,14.86 68,9.32 67.41,3.2 68.96,2.46 58.78,3.35 56.69,7.04 76.12,8.13 76.58,5.89 83.95,0.76 97.89,1.42 82.8,12.78 86.33,13.11 86.44,14.8 30.78,8.97 63.27,29.16 61.65,37.57 62.79,41.83 104.15,26.79 102.81,26.26 84.89,30.51 49.58,25.15 49.5,20.47 49.5,17.25 49.58,13.89 44.35,25.17 44.27,28.52 87.93,31.22 89.03,31.83 107.11,60.05 91.08,59.61 90.14,67.77 107.85,67.92 76.94,1.12 29.39,14.3 19.76,14.2 19.71,16.48 59,14.83 106.22,15.29 107.26,13.21 34.62,3.78 24.23,6.71 16.46,6.83 36.5,6.17 111.15,43.92 111.18,26.72 123.09,13.31 14.5,20.04 13.49,14.07 16.41,10.9 19.71,10.9 19.08,2.72 7.67,1.96 8.84,24.74 87.88,62.48 87.88,69.85 98.07,9.16 99.11,8.41 97.43,10.05 64.95,18.14 111.12,66.29 117.53,65.51 24.54,17.35 27.51,16.08 121.59,60.93 121.59,63.47 114.71,43.92 112.62,53.37 115.06,46.74 115.06,48.51 97.89,5.23 106.78,5.23 106.78,1.42 89,3.2 80.11,3.2 88.14,54.08 89.94,56.95 74.93,66.04 47.37,3.61 84.72,41.96 110.87,63.25
  pour Top (rank 4): 124.46,0 0,0 0,73.66 124.46,73.66
  pour Bottom (rank 4): 124.46,73.66 124.46,0 0,0 0,73.66
GND1  (via drill 0.3)
  other vias: 57.15,66.04
GND2  (via drill 0.3)
  other vias: 66.04,66.04
GND3  (via drill 0.3)
  other vias: 48.26,66.04
GND4  (via drill 0.3)
  other vias: 36.83,66.04
GND5  (via drill 0.3)
  other vias: 19.05,66.04
GND6  (via drill 0.3)
  other vias: 27.94,66.04
GND7  (via drill 0.3)
  other vias: 10.16,66.04
GND8  (via drill 0.3)
  other vias: 74.93,57.15
GND9  (via drill 0.3)
  other vias: 57.15,57.15
GND10  (via drill 0.3)
  other vias: 66.04,57.15
GND11  (via drill 0.3)
  other vias: 48.26,57.15
GND12  (via drill 0.3)
  other vias: 36.83,57.15
GND13  (via drill 0.3)
  other vias: 19.05,57.15
GND14  (via drill 0.3)
  other vias: 27.94,57.15
GND15  (via drill 0.3)
  other vias: 10.16,57.15
HOST_D+
  Top 0.203: J6.35 62.98,6.88 65.82,9.72 65.82,15.72 67.06,16.95 94.87,16.95 95.67,17.75 95.67,19.13 96.25,19.71 J1.35
HOST_D-
  Top 0.203: J6.37 62.48,6.85 65.49,9.86 65.49,15.91 66.87,17.29 94.56,17.29 95.34,18.07 95.34,19.27 95.75,19.68 J1.37
I2C_!INT!  (via drill 0.3)
  Top 0.203: J1.16 101,31.92 101.85,32.77 v101.85,34.04 | v98.32,37.57 96.37,39.52 46.38,39.52 42.52,35.66 42.52,17.73 42.06,17.27 v28.19,17.27 | v25.4,17.37 26.24,16.54 26.24,8.05 27.63,6.66 J7.23 27.63,1.58 v27.69,1.52 | J6.23 66.04,5.08 66.04,2.74 v65.1,1.8
  Bottom 0.203: v101.85,34.04 v98.32,37.57 | v25.4,17.37 25.5,17.27 v28.19,17.27 | v27.69,1.52 28.7,0.51 64.26,0.51 65.1,1.35 v65.1,1.8
I2C_SCL  (via drill 0.3)
  Top 0.203: v99.82,39.17 96.98,42.01 85.45,42.01 84.94,42.52 84.94,63.9 J2.4 84.84,68.56 J4.4 | v100.08,26.24 101.02,26.24 101.5,26.73 J1.14 101.5,30.99 103.35,32.84 v103.35,35.64 | v98.88,25.04 98.88,24.89 98.53,24.54 98.53,10.89 98.78,10.64 | v28.19,6.35 28.19,5.21 J7.21 | J6.21 66.48,6 66.88,6.4 v66.88,6.81 | v76.4,7.39 76.4,7.42 78.18,9.2 97.38,9.2 98.78,10.59 98.78,10.64 | 98.78,10.64 98.91,10.5 R15.1
  Bottom 0.203: v99.82,39.17 v103.35,35.64 | v100.08,26.24 100.08,26.19 98.93,25.04 v98.88,25.04 | v28.19,6.35 28.25,6.3 35.26,6.3 36.08,7.12 36.08,8.62 38.3,10.85 50.47,10.85 51.05,10.26 51.05,9.7 51.44,9.32 53.7,9.32 54.03,9.65 64.03,9.65 v66.88,6.81 66.98,6.91 75.92,6.91 v76.4,7.39
I2C_SCL1-PROCESSOR/QWIIC_EN  (via drill 0.3)
  Top 0.203: U4.3 89.03,52.86 89.03,52.96 89.66,53.59 89.66,54.61 89.92,54.86 90.59,54.86 R4.1 91.3,54.95 91.8,54.46 v91.8,48.34 | J1.53 91.75,22.29 v91.72,22.32 | v87.38,26.67 86.67,26.67 86.1,27.24 84.49,27.24 84.2,27.53 v84.2,30.45
  Bottom 0.203: v91.72,22.32 89,25.04 89,26.26 88.52,26.75 87.38,26.75 v87.38,26.67 | v84.2,30.45 84.2,46.38 84.63,46.81 90.27,46.81 v91.8,48.34
I2C_SDA  (via drill 0.3)
  Top 0.203: v100.61,39.14 97.13,42.62 86.09,42.62 85.95,42.77 85.85,42.86 85.84,42.88 85.84,62.22 85.84,62.23 J2.3 85.86,64.02 J4.3 | v100.58,25.65 101.4,25.65 102,26.26 J1.12 102,30.62 104.01,32.63 104.01,35.84 103.3,36.55 v103.28,36.55 | v99.42,24.41 98.86,23.85 98.86,11.53 99.11,11.28 103.21,11.28 103.38,11.11 R14.1 102.53,9.65 99.06,9.65 98.58,9.17 98.58,8.71 98.36,8.5 78.98,8.5 v76.99,6.5 | v67.49,6.38 66.98,5.87 J6.19 66.98,3.94 v67,3.91 | v28.63,3.91 | v28.63,3.91 J7.19
  Bottom 0.203: v100.61,39.14 103.2,36.55 v103.28,36.55 | v67.49,6.38 67.51,6.4 76.89,6.4 v76.99,6.5 | v100.58,25.65 100.58,25.6 99.42,24.43 v99.42,24.41 | v67,3.91 66.62,4.29 36.93,4.29 35.18,2.54 29.44,2.54 28.63,3.35 v28.63,3.91
N$1
  pour Top (isolate 0.305, no thermals): 112.04,42.9 112.04,41.76 113.31,41.76 113.31,36.27 111.53,36.27 111.53,42.9
N$2  (via drill 0.3)
  Top 0.203: D8.C v121.92,47.65
  Bottom 0.203: 5V_LED.2 v121.92,47.65
N$3
  Top 0.203: D3.A 121.53,41.03 121.56,41.06 R11.1
N$4
  Top 0.203: J3.B5 112.55,66.68 111.03,65.16 R2.2
N$5  (via drill 0.3)
  Top 0.203: v115.55,66.27 115.53,66.29 115.55,66.31 J3.A5 | v119.08,65.23 120.03,65.23 R1.2
  Bottom 0.203: v115.55,66.27 118.08,66.27 119.08,65.28 v119.08,65.23
N$6
  Top 0.203: R3.2 113.88,17.15 114.33,16.7 U2.5
N$10  (via drill 0.3)
  Top 0.203: D3.C v121.92,43.74
  Bottom 0.203: 3V3_LED.2 v121.92,43.74
N$11  (via drill 0.3)
  Top 0.203: R14.2 104.48,8.8 v104.65,8.64
  Bottom 0.203: I2C_PU.3 103.12,9.63 103.12,8.89 103.38,8.64 v104.65,8.64
N$12
  Top 0.203: R8.1 120.42,44.84 D8.A
N$13  (via drill 0.3)
  Top 0.203: R15.2 100.75,9.14 v99.36,9.14
  Bottom 0.203: v99.36,9.14 99.87,9.65 I2C_PU.1
N$14
  Top 0.203: R5.2 120.42,38.98 D4.C
N$15  (via drill 0.3)
  Top 0.203: R5.1 120.4,32 118.16,29.77 v116.15,29.77 | v110.74,26.06 110.74,16.41 110.96,16.19 U2.1
  Bottom 0.203: v116.15,29.77 112.45,26.06 v110.74,26.06
PROCESSOR_CAN-RX
  Top 0.203: J1.41 94.75,18.33 94.26,17.84 66.45,17.84 64.99,16.38 64.99,10.69 61.47,7.17 61.47,7.16 60.91,6.6 60.91,6.12 60.98,6.05 J6.43
PROCESSOR_CAN-TX  (via drill 0.3)
  Top 0.203: v60.79,7.21 60.98,7.21 64.64,10.87 64.64,16.61 66.22,18.19 93.88,18.19 94.25,18.56 J1.43 | v61.47,6.38 61.48,6.36 J6.41
  Bottom 0.203: v60.79,7.21 61.47,6.54 v61.47,6.38
PWM0-PROCESSOR
  Top 0.203: J1.32 97,31.07 96.5,31.57 96.5,36.21 94.36,38.35 49.17,38.35 46.46,35.64 46.46,8.48 47.35,7.59 58.7,7.59 58.98,7.31 J6.51
PWM1-PROCESSOR  (via drill 0.3)
  Top 0.203: J1.47 93.25,19.56 92.39,18.69 65.63,18.69 64.77,19.56 v58.17,19.56 | v23.85,9.83 21.34,9.83 20.63,9.12 J7.51 | v43.84,19.58 43.84,16.82 43,15.98 28.14,15.98 27.48,15.32 27.48,9.96 v27.64,9.8
  Bottom 0.203: v23.85,9.83 27.61,9.83 v27.64,9.8 | v43.84,19.58 58.17,19.58 v58.17,19.56
RTS1-PROCESSOR  (via drill 0.3)
  Top 0.203: J1.13 101.75,16.43 v101.8,16.38 | v95.02,16.38 67.94,16.38 67.23,15.67 J6.18
  Bottom 0.203: v95.02,16.38 v101.8,16.38
RX1-DFU_TX-FC0-PLEX
  Top 0.203: J6.4 70.73,10.66 69.96,9.89 67.28,9.89 64.42,7.03 64.42,4.13 62.8,2.52 45.97,2.52 45.54,2.95 45.54,6.17 44.65,7.07 U1.P9
RX1-DFU_TX-FC1-PLEX  (via drill 0.3)
  Top 0.203: J7.4 32.38,9.33 33.5,8.2 36.51,8.2 37.53,7.19 v40.84,7.19 | U1.P8 44.29,6.67 v44.42,6.53
  Bottom 0.203: v44.42,6.53 44.32,6.63 44.32,6.66 41.38,6.66 v40.84,7.19
RX1-PROCESSOR  (via drill 0.3)
  Top 0.203: v94.8,13.33 94.7,13.33 93.63,12.26 75.36,12.26 71.77,8.67 67.27,8.67 65.08,6.48 65.08,3.63 63.52,2.08 44.02,2.08 43.36,2.74 43.36,5.32 43.23,5.44 U1.P6 | v100.26,13.4 v100.25,13.41 J1.19
  Bottom 0.203: v100.26,13.4 94.87,13.4 v94.8,13.33
RX1-PROCESSOR-PLEX  (via drill 0.3)
  Top 0.203: J6.13 68.48,2.95 66.47,0.94 41.35,0.94 40.77,1.52 40.77,5.79 v41.12,6.15 | v44.09,5.86 44.09,5.98 43.81,6.26 U1.P7
  Bottom 0.203: v44.09,5.86 43.81,6.15 v41.12,6.15
RX2-PROCESSOR  (via drill 0.3)
  Top 0.203: J1.20 100,33.08 102.01,35.08 v102.01,35.13 | v99.01,38.12 99.01,38.2 97.1,40.11 44.15,40.11 41.53,37.49 41.53,19.2 40.64,18.31 27.89,18.31 27,17.42 27,9.68 30.13,6.55 J7.13
  Bottom 0.203: v99.01,38.12 v102.01,35.13
SDIO_DATA1/PWR_EN1_ALT  (via drill 0.3)
  Top 0.203: v87.25,24.64 88.14,24.64 88.5,25 J1.66 88.5,29.88 86.9,31.48 53.65,31.48 52.65,30.48 v52.65,25.96 | v83.31,14.87 83.29,14.85 v83.29,13.31 | J7.71 15.63,7.23 15.09,7.77 12.19,7.77 10.54,9.42 10.54,19.36 17.09,25.91 v37.08,25.91 | v84.07,5.08 84.07,4.57 83.57,4.06 82.55,4.06 82.33,4.28 S7.3
  Bottom 0.203: v87.25,24.64 86.92,24.64 83.31,21.03 v83.31,14.87 | v52.65,25.96 37.13,25.96 v37.08,25.91 | v83.29,13.31 83.36,13.23 83.36,6.3 84.07,5.59 v84.07,5.08
SDIO_DATA2/PWR_EN0_ALT  (via drill 0.3)
  Top 0.203: v87.91,25.32 88,25.42 J1.68 | v84.84,14.87 v84.84,13.21 | J6.71 53.95,5.11 53.95,3.83 v54,3.79 | v69.39,1.91 69.72,1.57 75.56,1.57 80.57,6.58 v84.81,6.58 88.67,6.58 90.2,5.05 S3.3
  Bottom 0.203: v87.91,25.32 87.91,24.46 84.84,21.39 v84.84,14.87 | v69.39,1.91 67.84,1.91 65.89,3.86 54.08,3.86 v54,3.79 | v84.81,6.58 84.81,13.18 v84.84,13.21
SHLD
  pour Bottom (isolate 0.305, no thermals): 118.36,67.31 118.36,72.69 109.73,72.69 109.73,67.31
  pour Top (isolate 0.305, no thermals): 109.73,67.31 109.73,72.69 118.62,72.69 118.62,67.31
SPI_PROCESSOR_SCK  (via drill 0.3)
  Top 0.203: J1.57 90.75,22.07 92,23.32 | 92,23.32 92.56,23.88 96.39,23.88 97.16,23.11 97.16,12.32 96.09,11.25 76.02,11.25 73.84,9.07 73.84,4.19 73.2,3.56 71.35,3.56 70.98,3.92 J6.3 70.98,7.44 v71.37,7.83 | v90.68,24.64 91.69,25.65 96.77,25.65 97.79,26.67 97.79,34.7 104.01,40.92 104.01,52.96 101.21,55.76 J10.5 | v92.46,22.86 92,23.32 | v31.32,9.75 31.32,9.28 32.63,7.97 J7.3
  Bottom 0.203: v90.68,24.64 v92.46,22.86 | v71.37,7.83 71.3,7.91 71.3,11.13 70.82,11.61 54.84,11.61 53.26,13.18 31.98,13.18 31.32,12.52 v31.32,9.75
SPI_PROCESSOR_SDI  (via drill 0.3)
  Top 0.203: J1.61 89.75,21.8 89.7,21.85 89.7,22.43 92.4,25.13 97.27,25.13 97.66,25.53 | 97.66,25.53 98.2,26.06 98.2,34.27 104.63,40.7 104.63,55.02 103.41,56.24 J10.7 | 97.66,25.53 98.16,25.04 98.16,11.53 96.56,9.93 76.55,9.93 75.34,8.72 75.34,3.35 74.27,2.29 70.87,2.29 69.98,3.17 J6.7 69.98,7.44 v69.67,7.75 | J7.7 31.62,6.91 v31.34,7.19
  Bottom 0.203: v69.67,7.75 69.67,9.83 69.19,10.31 53.86,10.31 52.58,11.6 37.96,11.6 34.87,8.51 32.66,8.51 v31.34,7.19
SPI_PROCESSOR_SDO  (via drill 0.3)
  Top 0.203: J1.59 90.23,20.91 v90.23,22.1 90.23,22.25 92.61,24.63 96.98,24.63 97.66,23.96 97.66,11.71 96.49,10.55 76.04,10.55 74.65,9.16 74.65,3.79 73.76,2.9 71.09,2.9 70.48,3.51 J6.5 70.48,7.74 v70.51,7.77 | v89.15,22.1 89.15,24.38 90.87,26.1 96.33,26.1 97.41,27.18 97.41,35.15 103.33,41.07 103.33,49.43 99.01,53.75 J10.3 | v31.06,8.26 32.13,7.19 J7.5
  Bottom 0.203: v89.15,22.1 v90.23,22.1 | v70.51,7.77 70.51,10.58 70.17,10.92 54.27,10.92 52.74,12.45 37.29,12.45 34.29,9.45 32.36,9.45 31.17,8.26 v31.06,8.26
SPI_SCK1-PROCESSOR  (via drill 0.3)
  Top 0.203: J1.60 90,31.66 87.89,33.77 52.59,33.77 50.55,31.73 v50.55,26.92 | v39.37,26.92 15.82,26.92 9.17,20.27 9.17,5.13 11,3.3 17.78,3.3 18.13,3.65 J7.61
  Bottom 0.203: v50.55,26.92 v39.37,26.92
SPI_SDO1-PROCESSOR  (via drill 0.3)
  Top 0.203: J1.62 89.5,30.51 87.12,32.89 53.44,32.89 51.56,31.01 v51.56,27.89 | v38.86,27.89 14.8,27.89 7.64,20.74 7.64,4.59 9.72,2.52 17.75,2.52 18.63,3.39 J7.59
  Bottom 0.203: v38.86,27.89 v51.56,27.89
SWDCK  (via drill 0.3)
  Top 0.203: J1.21 99.75,12.77 100.33,12.19 v105.41,12.19 | v117.6,12.45 118.36,13.21 118.36,16.84 119.05,17.53 122.38,17.53 122.94,16.97 122.94,14.35 122.55,13.96 J5.4
  Bottom 0.203: v105.41,12.19 117.35,12.19 v117.6,12.45
SWDIO  (via drill 0.3)
  Top 0.203: J1.23 99.25,12.25 99.82,11.68 v104.78,11.68 | v117.86,11.68 118.87,12.7 118.87,16.51 119.38,17.02 121.67,17.02 121.98,16.7 J5.2
  Bottom 0.203: J5.2 121.98,17.77 TP1.1 | v104.78,11.68 v117.86,11.68
TX1-DFU_RX-FC0-PLEX  (via drill 0.3)
  Top 0.203: v44.53,7.67 45.03,7.67 46.15,6.55 46.15,3.31 46.62,2.85 62.66,2.85 64.08,4.27 64.08,7.19 67.16,10.26 69.85,10.26 70.23,10.64 J6.6 | U1.P1 41.7,7.07 v41.55,7.21
  Bottom 0.203: v41.55,7.21 41.66,7.11 43.97,7.11 v44.53,7.67
TX1-DFU_RX-FC1-PLEX
  Top 0.203: J7.6 31.88,9.22 33.22,7.87 36.37,7.87 37.58,6.67 U1.P2
TX1-PROCESSOR  (via drill 0.3)
  Top 0.203: v100.75,12.83 100.75,12.93 100.78,12.96 100.78,20.86 J1.17 | v94.77,12.61 94.08,11.93 75.5,11.93 71.92,8.34 67.41,8.34 65.41,6.34 65.41,3.47 63.66,1.73 43.15,1.73 42.34,2.53 42.34,5.41 42.43,5.5 U1.P4
  Bottom 0.203: v100.75,12.83 100.63,12.83 100.62,12.83 94.98,12.83 v94.77,12.61
TX1-PROCESSOR-PLEX
  Top 0.203: J6.15 67.97,5.13 67.97,2.9 66.33,1.27 42.27,1.27 41.6,1.93 41.6,5.91 41.96,6.26 U1.P3
TX2-PROCESSOR  (via drill 0.3)
  Top 0.203: J1.22 99.5,33.39 v102.11,35.99 | v99.69,38.18 99.69,38.25 97.26,40.69 43.08,40.69 40.69,38.3 40.69,20.32 39.52,19.15 27.48,19.15 26.67,18.34 26.67,8.99 29.63,6.04 J7.15
  Bottom 0.203: v99.69,38.18 101.88,35.99 v102.11,35.99
V_BATT  (via drill 0.3)
  Top 0.559: Q1.3 110.74,56.13 108.56,53.95 108.56,31.39 109.73,30.23 109.73,14.86 110.3,14.29 U2.3 111.73,13.15 C4.1 112.18,11.43 113.28,10.33 113.28,6.86 114.05,6.1 114.05,5.08 | 114.05,5.08 114.05,4.83 113.3,4.08 J8.2 | 114.05,5.08 v115.57,5.08
  Bottom 0.559: v115.57,5.08 TP3.1
V_USB  (via drill 0.3)
  Top 0.203: 116.43,64.21 116.43,63.45 116.23,63.25 U3.5
  Top 0.254: J3.VBUS2 111.85,67.55 112.98,68.68 115.62,68.68 116.75,67.55 J3.VBUS1
  Top 0.559: F2.1 117.35,63.99 116.75,64.58 J3.VBUS1
  Bottom 0.559: BYP.1 117.55,62.92 v117.42,63.04
  pour Top (isolate 0.305, no thermals): 118.87,64.8 115.82,64.8 115.82,63.58 116.97,63.58 116.97,62.89 117.86,62.89 117.86,63.58 118.87,63.58
VCC  (via drill 0.3)
  Top 0.203: D4.A 121.04,38.1 119.38,38.1 118.87,37.59 118.87,34.8 117.86,33.78 v116.84,33.78 | v90.68,50.8 R4.2
  Top 0.559: U2.4 115,14.29 115.62,14.91 115.62,27.74 110.36,32.99 v110.36,33.78 110.11,34.04 v110.11,50.8 110.11,52.96 112.15,55 D5.C
  Bottom 0.203: v116.84,33.78 v110.36,33.78
  Bottom 0.559: v115.95,14.22 115.82,14.1 53.59,14.1 v53.47,14.22 53.47,14.33 52.78,15.01 15.9,15.01 v15.11,14.22 | v110.11,50.8 v90.68,50.8 88.9,50.8 88.39,50.29 v87.12,50.29
  pour Top (isolate 0.305, no thermals): 113.64,14.5 113.64,13.87 115.42,13.87 115.67,13.61 117.7,13.61 117.7,15.01 115.77,15.01 115.27,14.5
  pour Top (no thermals): 53.85,11.94 53.59,11.94 53.59,13.72 53.34,13.72 53.34,11.94 53.09,11.94 53.09,13.72 52.93,13.72 52.93,14.88 54.1,14.88 54.1,13.72 53.85,13.72
  pour Top (no thermals): 15.49,11.94 15.24,11.94 15.24,13.72 14.99,13.72 14.99,11.94 14.73,11.94 14.73,13.72 14.58,13.72 14.58,14.76 15.6,14.76 15.6,13.72 15.49,13.72
  pour Top (isolate 0.305, no thermals): 117.86,55.63 113.79,55.63 113.79,49.78 115.82,49.78 115.82,54.1 117.86,54.1
  pour Top (no thermals): 87.63,50.04 87.63,53.34 86.36,53.34 86.36,50.04
VCC_MEAS
  Top 0.203: R9.2 116.08,45.72 115.79,46.01 112.98,46.01 112.25,46.74 C5.1
  pour Top (isolate 0.305, no thermals): 113.03,51.56 113.03,45.97 112.01,45.97 112.01,44.96 111.25,44.96 111.25,51.56
VIN  (via drill 0.3)
  Top 0.203: R6.2 119.01,61.24 F2.2 | 114,19.3 R10.2 113.88,18.73 113.69,18.54 v111.25,18.54 | Q1.1 119.95,57.08 120.65,56.39 120.65,54.36 118.62,52.32 118.62,47.24 119.29,46.57 R8.2
  Top 0.254: J1.9 102.75,19.29 103.38,18.67
  Top 0.559: 103.38,18.67 105.97,18.67 v106.52,19.21 107.11,19.81 107.11,54.65 111.76,59.3 D5.A | D5.A 114.81,60.96 115.09,61.24 F2.2 | Q1.1 117.36,58.66 116.72,59.3 D5.A
  Bottom 0.203: v111.25,18.54 107.19,18.54 v106.52,19.21
  Bottom 0.559: v117.35,62.23 117.47,62.1 BYP.2 118.77,62.13 TP4.1
  pour Top (isolate 0.305, no thermals): 115.85,60.58 118.85,60.58 118.85,61.54 117.96,61.54 117.96,62.46 116.87,62.46 116.87,61.54 115.85,61.54
VIN/3  (via drill 0.3)
  Top 0.203: J1.49 92.75,21.84 93.06,22.15 v93.17,22.15 | R10.1 R7.2 112.18,21.93 v112.01,22.1
  Bottom 0.203: v112.01,22.1 93.22,22.1 v93.17,22.15

## Text on the board
Bottom: v12
tPlace: - | +
Measures: Units in Inches
tDocu: Elias Santistevan